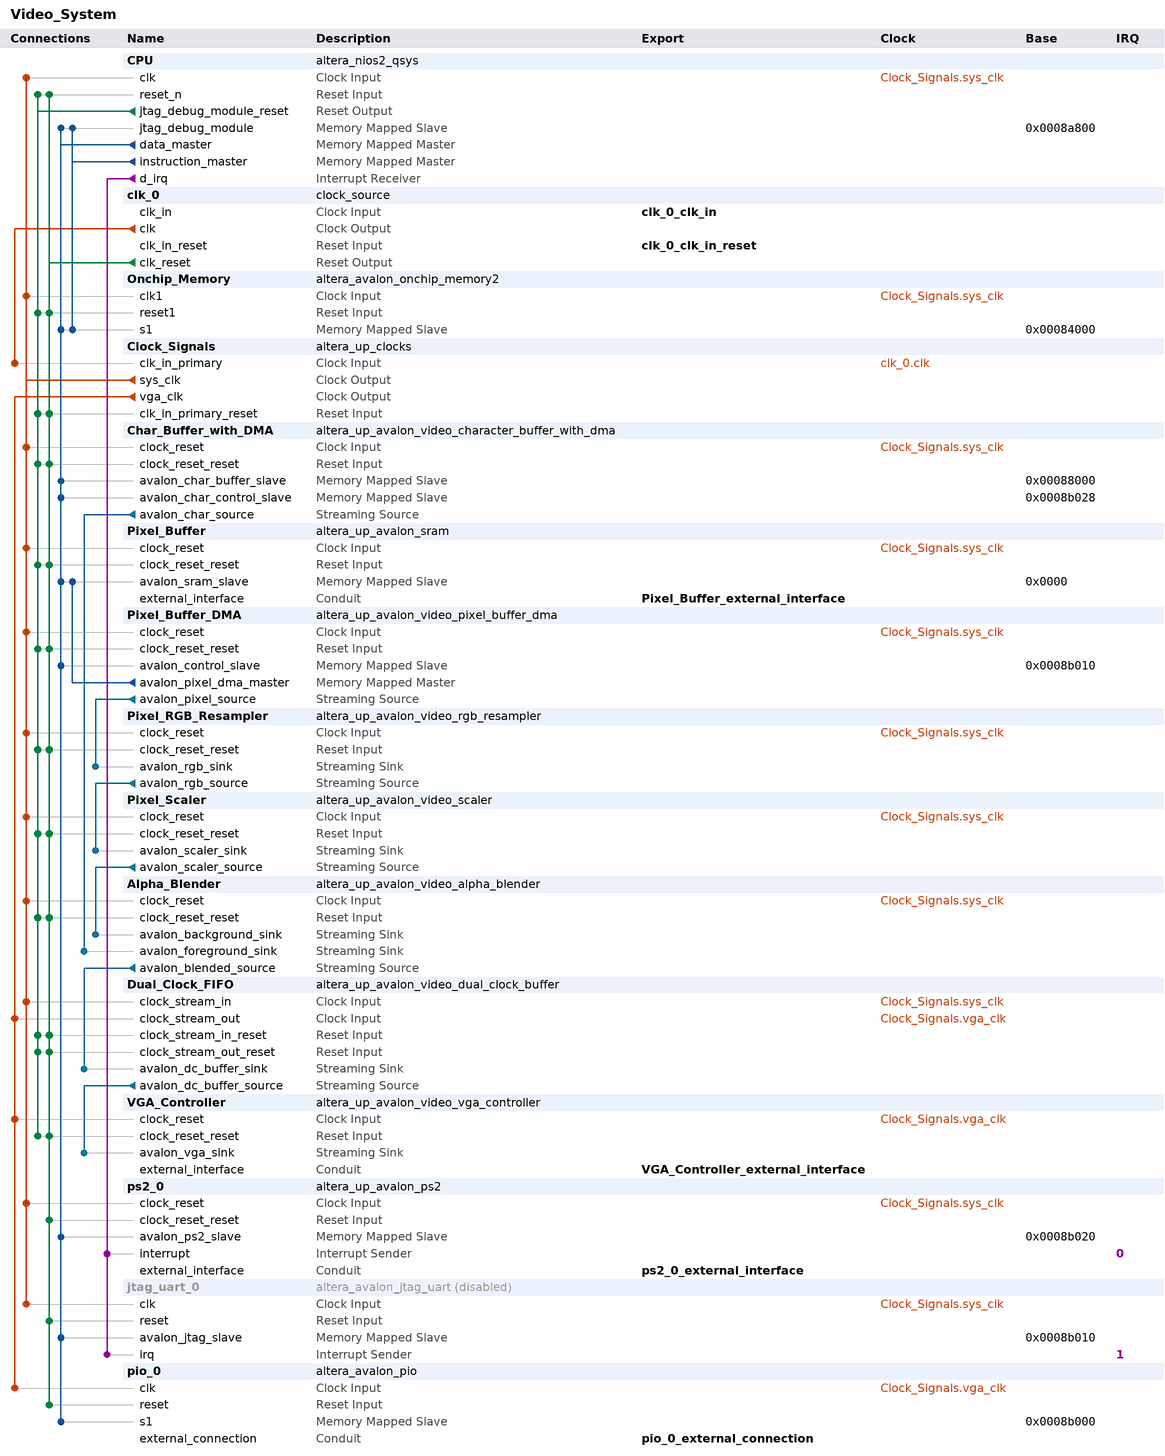
[diagram p0: system contents]
# Platform Designer (Qsys) system Video_System, Cyclone II EP2C20F484C7
# Parameters at their usual value, and those the tool derives, are not listed.
package require -exact qsys 13.0
create_system Video_System
set_project_property DEVICE_FAMILY {Cyclone II}
set_project_property DEVICE EP2C20F484C7

add_instance CPU altera_nios2_qsys 13.0
set_instance_parameter_value CPU manuallyAssignCpuID false
set_instance_parameter_value CPU resetSlave Onchip_Memory.s1
set_instance_parameter_value CPU exceptionSlave Onchip_Memory.s1
set_instance_parameter_value CPU breakSlave CPU.jtag_debug_module
set_instance_parameter_value CPU impl Tiny
set_instance_parameter_value CPU icache_size 4096

add_instance clk_0 clock_source 13.0
set_instance_parameter_value clk_0 clockFrequency 50000000

add_instance Onchip_Memory altera_avalon_onchip_memory2 13.0.1.99.2
set_instance_parameter_value Onchip_Memory dataWidth 32
set_instance_parameter_value Onchip_Memory dualPort false
set_instance_parameter_value Onchip_Memory initMemContent true
set_instance_parameter_value Onchip_Memory initializationFileName Onchip_Memory
set_instance_parameter_value Onchip_Memory memorySize 12500

add_instance Clock_Signals altera_up_clocks 13.0
set_instance_parameter_value Clock_Signals board DE2
set_instance_parameter_value Clock_Signals sdram_clk false
set_instance_parameter_value Clock_Signals vga_clk true
set_instance_parameter_value Clock_Signals audio_clk false
set_instance_parameter_value Clock_Signals audio_clk_freq 12.288

add_instance Char_Buffer_with_DMA altera_up_avalon_video_character_buffer_with_dma 13.0
set_instance_parameter_value Char_Buffer_with_DMA enable_transparency true

add_instance Pixel_Buffer altera_up_avalon_sram 13.0
set_instance_parameter_value Pixel_Buffer board DE2
set_instance_parameter_value Pixel_Buffer pixel_buffer true

add_instance Pixel_Buffer_DMA altera_up_avalon_video_pixel_buffer_dma 13.0
set_instance_parameter_value Pixel_Buffer_DMA addr_mode X-Y
set_instance_parameter_value Pixel_Buffer_DMA start_address 0
set_instance_parameter_value Pixel_Buffer_DMA back_start_address 0
set_instance_parameter_value Pixel_Buffer_DMA image_width 320
set_instance_parameter_value Pixel_Buffer_DMA image_height 240
set_instance_parameter_value Pixel_Buffer_DMA color_space {16-bit RGB}

add_instance Pixel_RGB_Resampler altera_up_avalon_video_rgb_resampler 13.0
set_instance_parameter_value Pixel_RGB_Resampler input_type {16-bit RGB}
set_instance_parameter_value Pixel_RGB_Resampler output_type {30-bit RGB}
set_instance_parameter_value Pixel_RGB_Resampler alpha 255

add_instance Pixel_Scaler altera_up_avalon_video_scaler 13.0
set_instance_parameter_value Pixel_Scaler width_scaling 2
set_instance_parameter_value Pixel_Scaler height_scaling 2
set_instance_parameter_value Pixel_Scaler width_in 320
set_instance_parameter_value Pixel_Scaler color_bits 10
set_instance_parameter_value Pixel_Scaler color_planes 3

add_instance Alpha_Blender altera_up_avalon_video_alpha_blender 13.0

add_instance Dual_Clock_FIFO altera_up_avalon_video_dual_clock_buffer 13.0
set_instance_parameter_value Dual_Clock_FIFO color_bits 10

add_instance VGA_Controller altera_up_avalon_video_vga_controller 13.0
set_instance_parameter_value VGA_Controller board DE2

add_instance ps2_0 altera_up_avalon_ps2 13.0

add_instance jtag_uart_0 altera_avalon_jtag_uart 13.0.1.99.2
set_instance_property jtag_uart_0 ENABLED false
set_instance_parameter_value jtag_uart_0 simInteractiveOptions NO_INTERACTIVE_WINDOWS

add_instance pio_0 altera_avalon_pio 13.0.1.99.2
set_instance_parameter_value pio_0 direction Input
set_instance_parameter_value pio_0 width 4

# connections
add_connection clk_0.clk Clock_Signals.clk_in_primary clock
add_connection Clock_Signals.sys_clk Alpha_Blender.clock_reset clock
add_connection Clock_Signals.sys_clk Char_Buffer_with_DMA.clock_reset clock
add_connection Clock_Signals.sys_clk CPU.clk clock
add_connection Clock_Signals.sys_clk Dual_Clock_FIFO.clock_stream_in clock
add_connection Clock_Signals.sys_clk jtag_uart_0.clk clock
add_connection Clock_Signals.sys_clk Onchip_Memory.clk1 clock
add_connection Clock_Signals.sys_clk Pixel_Buffer.clock_reset clock
add_connection Clock_Signals.sys_clk Pixel_Buffer_DMA.clock_reset clock
add_connection Clock_Signals.sys_clk Pixel_RGB_Resampler.clock_reset clock
add_connection Clock_Signals.sys_clk Pixel_Scaler.clock_reset clock
add_connection Clock_Signals.sys_clk ps2_0.clock_reset clock
add_connection Clock_Signals.vga_clk Dual_Clock_FIFO.clock_stream_out clock
add_connection Clock_Signals.vga_clk pio_0.clk clock
add_connection Clock_Signals.vga_clk VGA_Controller.clock_reset clock
add_connection clk_0.clk_reset Alpha_Blender.clock_reset_reset reset
add_connection clk_0.clk_reset Char_Buffer_with_DMA.clock_reset_reset reset
add_connection clk_0.clk_reset Clock_Signals.clk_in_primary_reset reset
add_connection clk_0.clk_reset CPU.reset_n reset
add_connection clk_0.clk_reset Dual_Clock_FIFO.clock_stream_in_reset reset
add_connection clk_0.clk_reset Dual_Clock_FIFO.clock_stream_out_reset reset
add_connection clk_0.clk_reset jtag_uart_0.reset reset
add_connection clk_0.clk_reset Onchip_Memory.reset1 reset
add_connection clk_0.clk_reset pio_0.reset reset
add_connection clk_0.clk_reset Pixel_Buffer.clock_reset_reset reset
add_connection clk_0.clk_reset Pixel_Buffer_DMA.clock_reset_reset reset
add_connection clk_0.clk_reset Pixel_RGB_Resampler.clock_reset_reset reset
add_connection clk_0.clk_reset Pixel_Scaler.clock_reset_reset reset
add_connection clk_0.clk_reset ps2_0.clock_reset_reset reset
add_connection clk_0.clk_reset VGA_Controller.clock_reset_reset reset
add_connection CPU.jtag_debug_module_reset Alpha_Blender.clock_reset_reset reset
add_connection CPU.jtag_debug_module_reset Char_Buffer_with_DMA.clock_reset_reset reset
add_connection CPU.jtag_debug_module_reset Clock_Signals.clk_in_primary_reset reset
add_connection CPU.jtag_debug_module_reset CPU.reset_n reset
add_connection CPU.jtag_debug_module_reset Dual_Clock_FIFO.clock_stream_in_reset reset
add_connection CPU.jtag_debug_module_reset Dual_Clock_FIFO.clock_stream_out_reset reset
add_connection CPU.jtag_debug_module_reset Onchip_Memory.reset1 reset
add_connection CPU.jtag_debug_module_reset Pixel_Buffer.clock_reset_reset reset
add_connection CPU.jtag_debug_module_reset Pixel_Buffer_DMA.clock_reset_reset reset
add_connection CPU.jtag_debug_module_reset Pixel_RGB_Resampler.clock_reset_reset reset
add_connection CPU.jtag_debug_module_reset Pixel_Scaler.clock_reset_reset reset
add_connection CPU.jtag_debug_module_reset VGA_Controller.clock_reset_reset reset
add_connection CPU.data_master Char_Buffer_with_DMA.avalon_char_buffer_slave avalon
set_connection_parameter_value CPU.data_master/Char_Buffer_with_DMA.avalon_char_buffer_slave baseAddress 0x00088000
add_connection CPU.data_master Char_Buffer_with_DMA.avalon_char_control_slave avalon
set_connection_parameter_value CPU.data_master/Char_Buffer_with_DMA.avalon_char_control_slave baseAddress 0x0008b028
add_connection CPU.data_master CPU.jtag_debug_module avalon
set_connection_parameter_value CPU.data_master/CPU.jtag_debug_module baseAddress 0x0008a800
add_connection CPU.data_master jtag_uart_0.avalon_jtag_slave avalon
set_connection_parameter_value CPU.data_master/jtag_uart_0.avalon_jtag_slave baseAddress 0x0008b010
add_connection CPU.data_master Onchip_Memory.s1 avalon
set_connection_parameter_value CPU.data_master/Onchip_Memory.s1 baseAddress 0x00084000
add_connection CPU.data_master pio_0.s1 avalon
set_connection_parameter_value CPU.data_master/pio_0.s1 baseAddress 0x0008b000
add_connection CPU.data_master Pixel_Buffer.avalon_sram_slave avalon
set_connection_parameter_value CPU.data_master/Pixel_Buffer.avalon_sram_slave baseAddress 0x0000
add_connection CPU.data_master Pixel_Buffer_DMA.avalon_control_slave avalon
set_connection_parameter_value CPU.data_master/Pixel_Buffer_DMA.avalon_control_slave baseAddress 0x0008b010
add_connection CPU.data_master ps2_0.avalon_ps2_slave avalon
set_connection_parameter_value CPU.data_master/ps2_0.avalon_ps2_slave baseAddress 0x0008b020
add_connection CPU.instruction_master CPU.jtag_debug_module avalon
set_connection_parameter_value CPU.instruction_master/CPU.jtag_debug_module baseAddress 0x0008a800
add_connection CPU.instruction_master Onchip_Memory.s1 avalon
set_connection_parameter_value CPU.instruction_master/Onchip_Memory.s1 baseAddress 0x00084000
add_connection Pixel_Buffer_DMA.avalon_pixel_dma_master Pixel_Buffer.avalon_sram_slave avalon
set_connection_parameter_value Pixel_Buffer_DMA.avalon_pixel_dma_master/Pixel_Buffer.avalon_sram_slave baseAddress 0x0000
add_connection Alpha_Blender.avalon_blended_source Dual_Clock_FIFO.avalon_dc_buffer_sink avalon_streaming
add_connection Char_Buffer_with_DMA.avalon_char_source Alpha_Blender.avalon_foreground_sink avalon_streaming
add_connection Dual_Clock_FIFO.avalon_dc_buffer_source VGA_Controller.avalon_vga_sink avalon_streaming
add_connection Pixel_Buffer_DMA.avalon_pixel_source Pixel_RGB_Resampler.avalon_rgb_sink avalon_streaming
add_connection Pixel_RGB_Resampler.avalon_rgb_source Pixel_Scaler.avalon_scaler_sink avalon_streaming
add_connection Pixel_Scaler.avalon_scaler_source Alpha_Blender.avalon_background_sink avalon_streaming
add_connection CPU.d_irq jtag_uart_0.irq interrupt
set_connection_parameter_value CPU.d_irq/jtag_uart_0.irq irqNumber 1
add_connection CPU.d_irq ps2_0.interrupt interrupt
set_connection_parameter_value CPU.d_irq/ps2_0.interrupt irqNumber 0

# exported interfaces
add_interface VGA_Controller_external_interface conduit end
set_interface_property VGA_Controller_external_interface EXPORT_OF VGA_Controller.external_interface
add_interface clk_0_clk_in clock sink
set_interface_property clk_0_clk_in EXPORT_OF clk_0.clk_in
add_interface clk_0_clk_in_reset reset sink
set_interface_property clk_0_clk_in_reset EXPORT_OF clk_0.clk_in_reset
add_interface Pixel_Buffer_external_interface conduit end
set_interface_property Pixel_Buffer_external_interface EXPORT_OF Pixel_Buffer.external_interface
add_interface ps2_0_external_interface conduit end
set_interface_property ps2_0_external_interface EXPORT_OF ps2_0.external_interface
add_interface pio_0_external_connection conduit end
set_interface_property pio_0_external_connection EXPORT_OF pio_0.external_connection

set_interconnect_requirement {$system} qsys_mm.clockCrossingAdapter HANDSHAKE
set_interconnect_requirement {$system} qsys_mm.maxAdditionalLatency 0

save_system Video_System.qsys
